# EAGLE design esquema-a4988 (EAGLE 9.3.0)
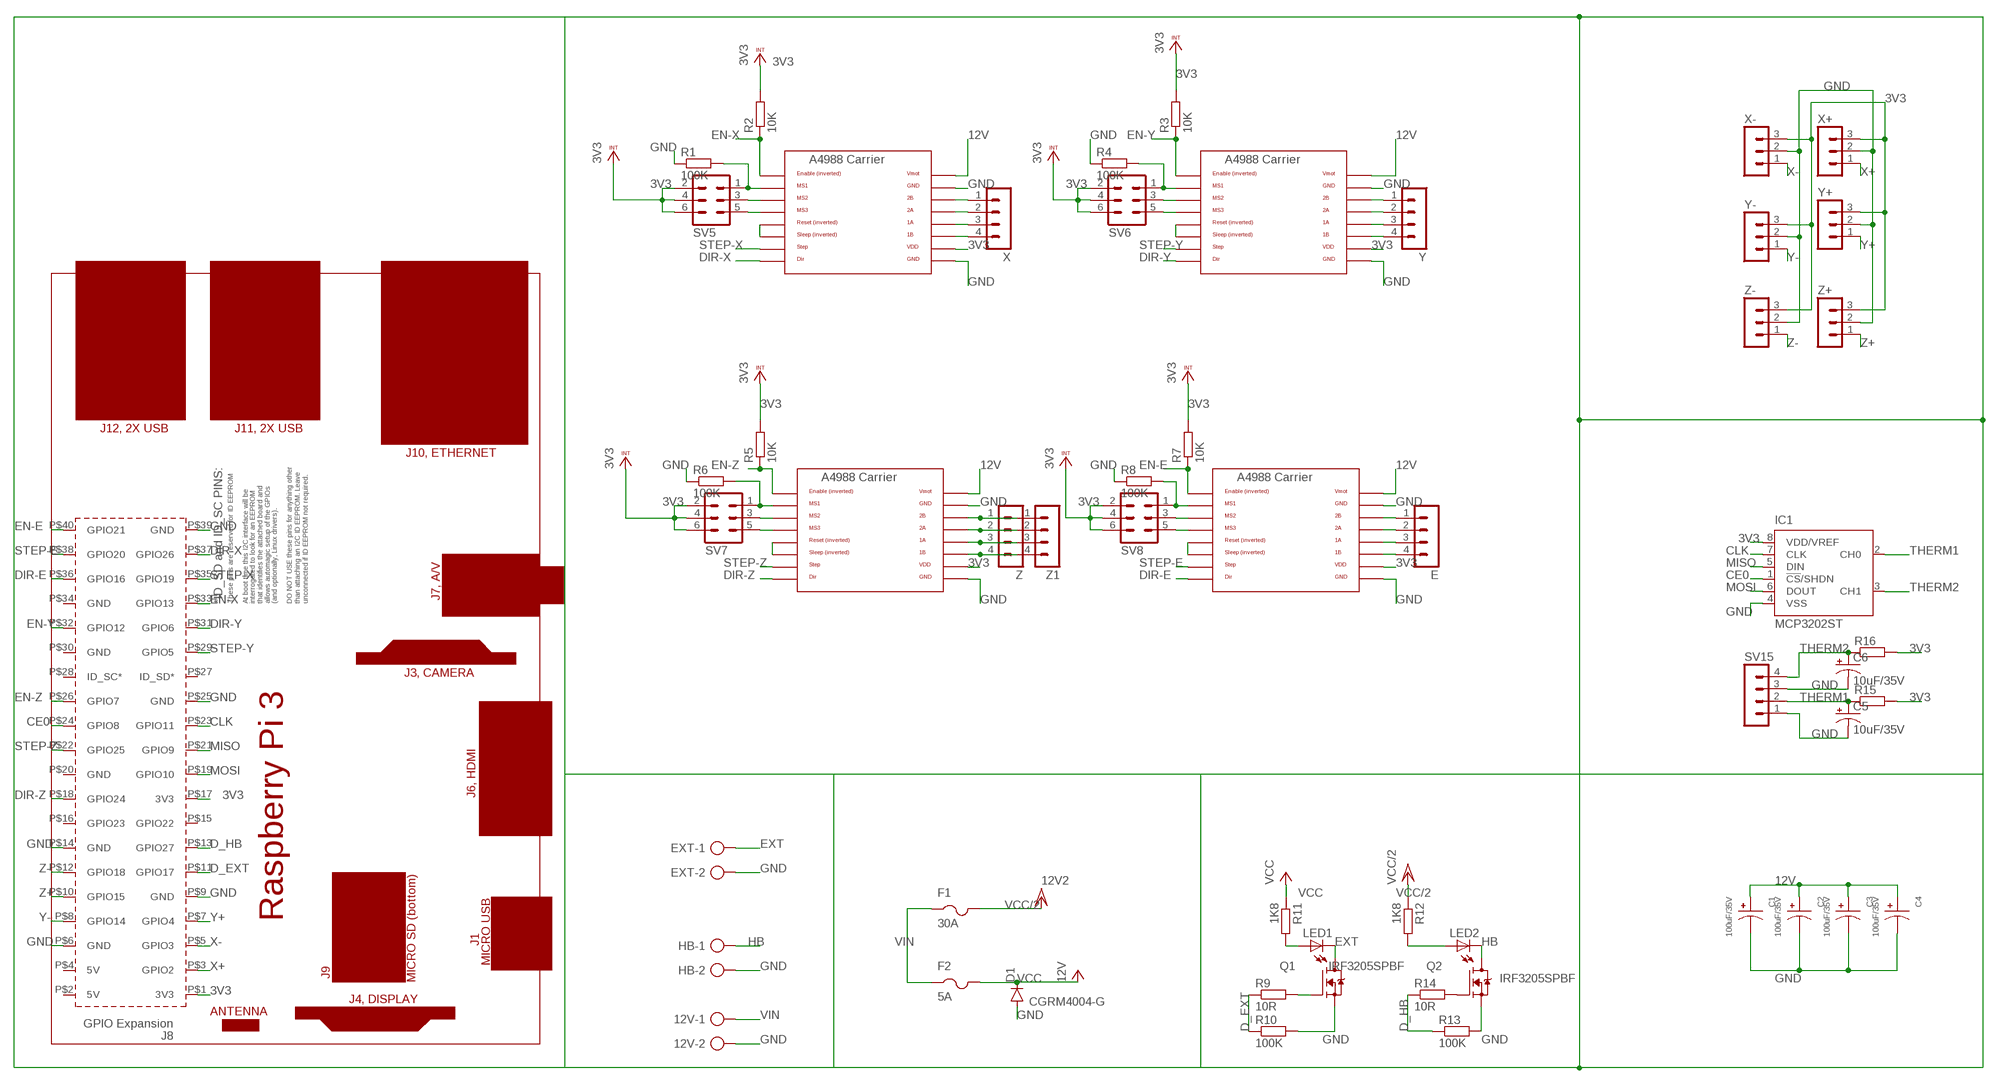
[diagram p0: schematic, sheet 1]

## Parts
12V  AK500/2  [AK500/2]
C1  100uF/35V  EEE-FTH101XAP  [CAPAE660X800N]
C2  100uF/35V  EEE-FTH101XAP  [CAPAE660X800N]
C3  100uF/35V  EEE-FTH101XAP  [CAPAE660X800N]
C4  100uF/35V  EEE-FTH101XAP  [CAPAE660X800N]
C5  10uF/35V  CPOL-US153CLV-0405  [153CLV-0405]
C6  10uF/35V  CPOL-US153CLV-0405  [153CLV-0405]
D1  CGRM4004-G  [SOD-123_MINI-SMA]
E  MA04-1  [MA04-1]
EXT  AK500/2  [AK500/2]
F1  30A  PTCFUSE-1206  [R1206]
F2  5A  PTCFUSE-1206  [R1206]
HB  AK500/2  [AK500/2]
IC1  MCP3202ST  [TSSOP8]
LED1  LEDCHIPLED_1206  [CHIPLED_1206]
LED2  LEDCHIPLED_1206  [CHIPLED_1206]
PCB1  RPI3RPI3  [RPI3]
Q1  IRF3205SPBF  [TRANS_IRF3205SPBF]
Q2  IRF3205SPBF  [TRANS_IRF3205SPBF]
R1  100K  RR1206  [R1206]
R2  10K  RR1206  [R1206]
R3  10K  RR1206  [R1206]
R4  100K  RR1206  [R1206]
R5  10K  RR1206  [R1206]
R6  100K  RR1206  [R1206]
R7  10K  RR1206  [R1206]
R8  100K  RR1206  [R1206]
R9  10R  RR1206  [R1206]
R10  100K  RR1206  [R1206]
R11  1K8  RR1206  [R1206]
R12  1K8  RR1206  [R1206]
R13  100K  RR1206  [R1206]
R14  10R  RR1206  [R1206]
R15  RR1206  [R1206]
R16  RR1206  [R1206]
SV5  MA03-2  [MA03-2]
SV6  MA03-2  [MA03-2]
SV7  MA03-2  [MA03-2]
SV8  MA03-2  [MA03-2]
SV15  MA04-1  [MA04-1]
U$1  A4983CARRIER  [A4988BREAKOUT]
U$2  A4983CARRIER  [A4988BREAKOUT]
U$3  A4983CARRIER  [A4988BREAKOUT]
U$4  A4983CARRIER  [A4988BREAKOUT]
X  MA04-1  [MA04-1]
X+  MA03-1  [MA03-1]
X-  MA03-1  [MA03-1]
Y  MA04-1  [MA04-1]
Y+  MA03-1  [MA03-1]
Y-  MA03-1  [MA03-1]
Z  MA04-1  [MA04-1]
Z1  MA04-1  [MA04-1]
Z+  MA03-1  [MA03-1]
Z-  MA03-1  [MA03-1]

## Nets
3V3: IC1.8(VDD/VREF) PCB1.P$1(3V3) PCB1.P$17(3V3) R2.2 R3.2 R5.2 R7.2 R15.2 R16.2 SV5.2 SV5.4 SV5.6 SV6.2 SV6.4 SV6.6 SV7.2 SV7.4 SV7.6 SV8.2 SV8.4 SV8.6 U$1.VDD U$2.VDD U$3.VDD U$4.VDD X+.3 X-.3 Y+.3 Y-.3 Z+.3 Z-.3
12V: C1.1 C2.1 C3.1 C4.1 U$1.VMOT U$2.VMOT U$3.VMOT U$4.VMOT
CE0: IC1.1(!CS!/SHDN) PCB1.P$24(GPIO8)
CLK: IC1.7(CLK) PCB1.P$23(GPIO11)
D_EXT: PCB1.P$11(GPIO17) R9.1 R10.1
D_HB: PCB1.P$13(GPIO27) R13.1 R14.1
DIR-E: PCB1.P$36(GPIO16) U$4.DIR
DIR-X: PCB1.P$37(GPIO26) U$1.DIR
DIR-Y: PCB1.P$31(GPIO6) U$2.DIR
DIR-Z: PCB1.P$18(GPIO24) U$3.DIR
EN-E: PCB1.P$40(GPIO21) R7.1 U$4.EN
EN-X: PCB1.P$33(GPIO13) R2.1 U$1.EN
EN-Y: PCB1.P$32(GPIO12) R3.1 U$2.EN
EN-Z: PCB1.P$26(GPIO7) R5.1 U$3.EN
EXT: EXT.1 LED1.C Q1.2(D)
GND: 12V.2 C1.2 C2.2 C3.2 C4.2 C5.- C6.- D1.A EXT.2 HB.2 IC1.4(VSS) PCB1.P$6(GND) PCB1.P$9(GND) PCB1.P$14(GND) PCB1.P$25(GND) PCB1.P$39(GND) Q1.3(S) Q2.3(S) R1.1 R4.1 R6.1 R8.1 R10.2 R13.2 SV15.1 SV15.3 U$1.GND U$1.GND@0(GND) U$2.GND U$2.GND@0(GND) U$3.GND U$3.GND@0(GND) U$4.GND U$4.GND@0(GND) X+.2 X-.2 Y+.2 Y-.2 Z+.2 Z-.2
HB: HB.1 LED2.C Q2.2(D)
MISO: IC1.5(DIN) PCB1.P$21(GPIO9)
MOSI: IC1.6(DOUT) PCB1.P$19(GPIO10)
N$1: R1.2 SV5.1 U$1.MS1
N$2: SV5.3 U$1.MS2
N$3: SV5.5 U$1.MS3
N$4: R4.2 SV6.1 U$2.MS1
N$5: SV6.3 U$2.MS2
N$6: SV6.5 U$2.MS3
N$7: R6.2 SV7.1 U$3.MS1
N$8: SV7.3 U$3.MS2
N$9: SV7.5 U$3.MS3
N$10: R8.2 SV8.1 U$4.MS1
N$11: SV8.3 U$4.MS2
N$12: SV8.5 U$4.MS3
N$13: U$3.2B Z1.1 Z.1
N$14: U$3.2A Z1.2 Z.2
N$15: U$3.1A Z1.3 Z.3
N$16: U$3.1B Z1.4 Z.4
N$17: E.1 U$4.2B
N$18: E.2 U$4.2A
N$19: E.3 U$4.1A
N$20: E.4 U$4.1B
N$21: U$2.2B Y.1
N$22: U$2.2A Y.2
N$23: U$2.1A Y.3
N$24: U$2.1B Y.4
N$25: U$1.2B X.1
N$26: U$1.2A X.2
N$27: U$1.1A X.3
N$28: U$1.1B X.4
N$31: LED1.A R11.2
N$32: LED2.A R12.2
N$33: Q1.1(G) R9.2
N$35: Q2.1(G) R14.2
N$44: U$3.RST U$3.SLP(SLEEP)
N$46: U$4.RST U$4.SLP(SLEEP)
N$47: U$2.RST U$2.SLP(SLEEP)
N$48: U$1.RST U$1.SLP(SLEEP)
STEP-E: PCB1.P$38(GPIO20) U$4.STEP
STEP-X: PCB1.P$35(GPIO19) U$1.STEP
STEP-Y: PCB1.P$29(GPIO5) U$2.STEP
STEP-Z: PCB1.P$22(GPIO25) U$3.STEP
THERM1: C5.+ IC1.2(CH0) R15.1 SV15.2
THERM2: C6.+ IC1.3(CH1) R16.1 SV15.4
VCC: D1.C F2.2 R11.1 ; supply symbol labelled 12V
VCC/2: F1.2 R12.1 ; supply symbol labelled 12V2
VIN: 12V.1 F1.1 F2.1
X+: PCB1.P$3(GPIO2) X+.1
X-: PCB1.P$5(GPIO3) X-.1
Y+: PCB1.P$7(GPIO4) Y+.1
Y-: PCB1.P$8(GPIO14) Y-.1
Z+: PCB1.P$10(GPIO15) Z+.1
Z-: PCB1.P$12(GPIO18) Z-.1
Unconnected: PCB1.P$2(5V) PCB1.P$4(5V) PCB1.P$15(GPIO22) PCB1.P$16(GPIO23) PCB1.P$20(GND) PCB1.P$27(ID_SD*) PCB1.P$28(ID_SC*) PCB1.P$30(GND) PCB1.P$34(GND)

## Library data of the parts
12V EXT HB = con-ptr500:AK500/2: CONNECTOR; OC_FARNELL: unknown; OC_NEWARK: unknown
C1-C4 = EEE-FTH101XAP:EEE-FTH101XAP: Cap Aluminum Lytic 100uF 50V 20% (6.3 X 7.7mm) SMD 0.34 Ohm 350mA 2000h 105Â°C Automotive T/R; AVAILABILITY: Unavailable; DESCRIPTION: Cap Aluminum Lytic 100uF 50V 20% _6.3 X 7.7mm_ SMD 0.34 Ohm 350mA 2000h 105°C Automotive T/R; MF: Panasonic Electronic; MP: EEE-FTH101XAP; PACKAGE: Radial Panasonic Electronic; PRICE: None
C5 C6 = adafruit:CPOL-US: POLARIZED CAPACITOR, American symbol
D1 = diode:CGRM400*-G: Molded plasitc,JEDEC SOD-123/Mini SMA Source: Comchip CGRM4001-G.pdf
E SV15 X Y Z Z1 = con-lstb:MA04-1: PIN HEADER; OC_FARNELL: unknown; OC_NEWARK: unknown
F1 F2 = adafruit:PTCFUSE: PTC fuses, resettable thermistors
IC1 = microchip:MCP3202: 2.7V Dual Channel 12-Bit A/D Converter with SPI Serial Interface Source: http://ww1.microchip.com/downloads/en/DeviceDoc/21034D.pdf; MF: MICROCHIP; MPN: MCP3202-CI/ST; OC_FARNELL: unknown; OC_NEWARK: 59K0226
LED1 LED2 = adafruit:LED: LED OSRAM: - CHIPLED LG R971, LG N971, LY N971, LG Q971, LY Q971, LO R971, LY R971 LH N974, LH R974 LS Q976, LO Q976, LY Q976 LO Q996 - Hyper CHIPLED LW Q18S LB Q993, LB Q99A, LB R99A - SideLED LS A670, LO A670, LY A670, LG A670, LP A670 LB A673, LV A673, LT A673, LW A673 LH A674 LY A675 LS A676, LA A676, LO A676, LY A676, LW A676 LS A679, LY A679, LG A679 - Hyper Micro SIDELED® LS Y876, LA Y876, LO Y876, LY Y876 LT Y87S - SmartLED LW L88C, LW L88S LB L89C, LB L89S, LG L890 LS L89K, LO L89K, LY L89K LS L896, LA L896, LO L896, LY L896 - TOPLED LS T670, LO T670, LY T670, LG T670, LP T670 LSG T670, LSP T670, LSY T670, LOP T670, LYG T670 LG T671, LOG T671, LSG T671 LB T673, LV T673, LT T673, LW T673 LH T674 LS T676, LA T676, LO T676, LY T676, LB T676, LH T676, LSB T676, LW T676 LB T67C, LV T67C, LT T67C, LS T67K, LO T67K, LY T67K, LW E67C LS E67B, LA E67B, LO E67B, LY E67B, LB E67C, LV E67C, LT E67C LW T67C LS T679, LY T679, LG T679 LS T770, LO T770, LY T770, LG T770, LP T770 LB T773, LV T773, LT T773, LW T773 LH T774 LS E675, LA E675, LY E675, LS T675 LS T776, LA T776, LO T776, LY T776, LB T776 LHGB T686 LT T68C, LB T68C - Hyper Mini TOPLED® LB M676 - Mini TOPLED Santana® LG M470 LS M47K, LO M47K, LY M47K Source: http://www.osram.convergy.de/
PCB1 = e14_Rpi3_RevA+mirror-pcb:RPI3: Device for Raspberry Pi 3 board created by Dave Young for www.element14.com More information and support community is available at https://www.element14.com/community/community/raspberry-pi Device for Raspberry Pi 3 board updated by Gerald Schwarz for www.element14.com On RPI3 addet the layer milling and created a mirrored shield.
Q1 Q2 = IRF3205SPBF:IRF3205SPBF: Single N-Channel 55 V 200 W 146 nC Hexfet Power Mosfet Surface Mount - D2PAK-3; AVAILABILITY: Unavailable; DESCRIPTION: Single N-Channel 55 V 200 W 146 nC Hexfet Power Mosfet Surface Mount - D2PAK-3; MF: Infineon Technologies; MP: IRF3205SPBF; PACKAGE: D2PAK Infineon; PRICE: None
R1-R16 = eagle-ltspice:R: RESISTOR, European symbol; SPICEMODEL: NONE; SPICEPREFIX: R
SV5-SV8 = con-lstb:MA03-2: PIN HEADER; OC_FARNELL: unknown; OC_NEWARK: unknown
U$1-U$4 = RepRapjr:A4983CARRIER
X+ X- Y+ Y- Z+ Z- = con-lstb:MA03-1: PIN HEADER; OC_FARNELL: unknown; OC_NEWARK: unknown

## Board
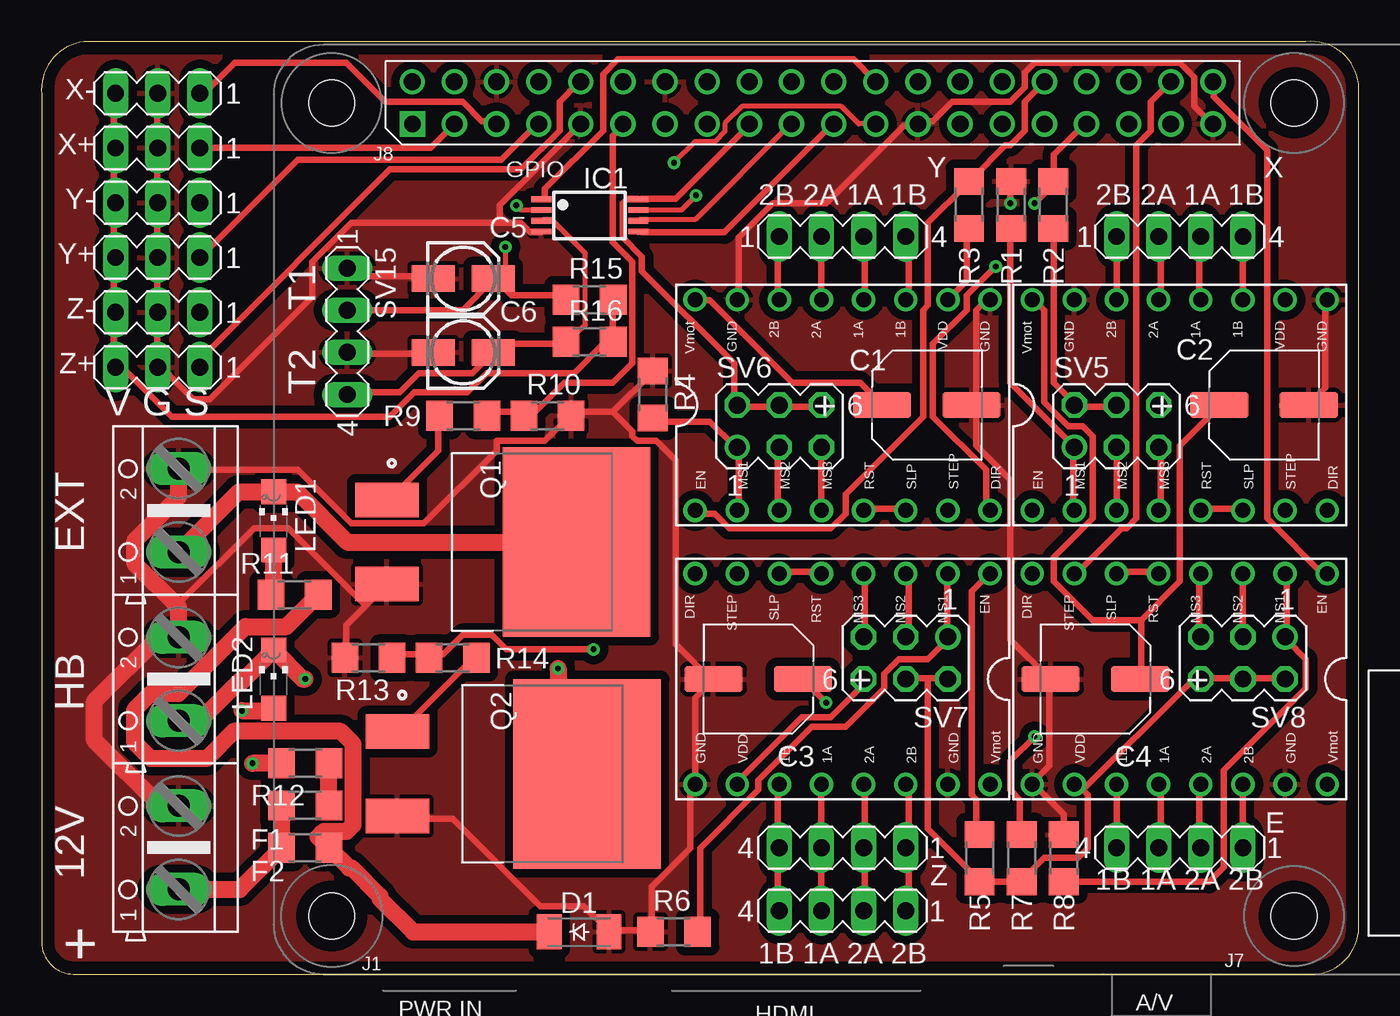
[diagram p1: board, top side]
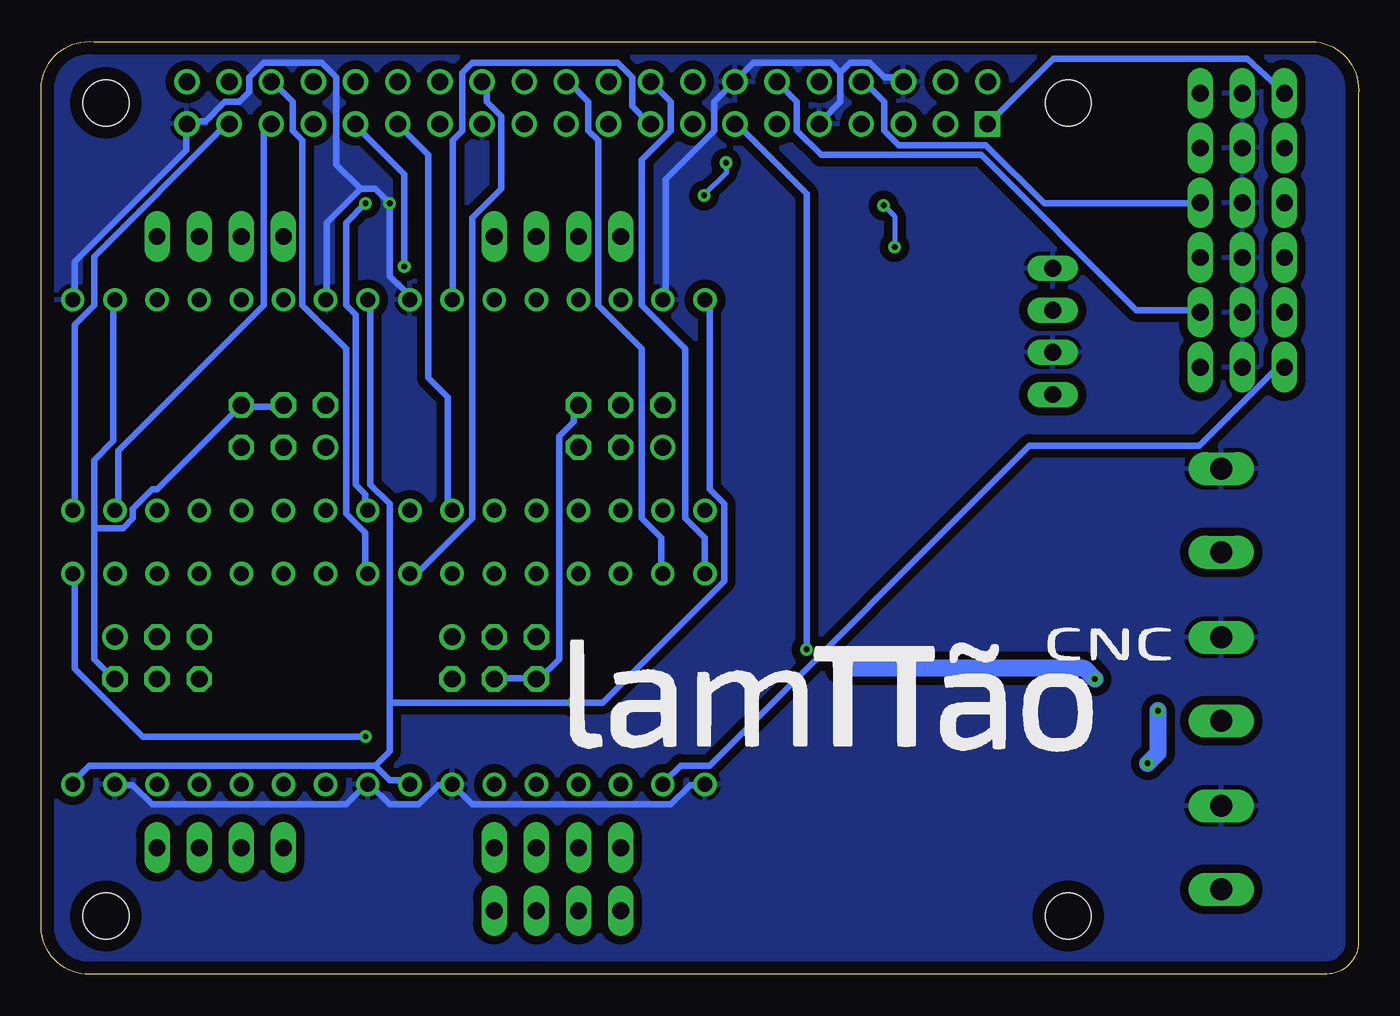
[diagram p2: board, bottom side, seen from below]

Size 79.37 x 56.22 mm. Coordinates in mm from the lower left corner, seen from the top.
Outline: 0.02,53.03 0.02,1.92 arc90 1.92,0.02 76.2,0.02 arc90 79.37,2.56 79.37,53.66 arc90 76.2,56.2 2.56,56.2 arc90 0.02,53.03
Copper layers (1*16): Top 0.035mm / dielectric 1.5mm / Bottom 0.035mm
Design rules "default *": minimum track width 12mil, minimum drill 0.35mm, track to track 8mil, track to pad 6mil, pad to pad 6mil, via to via 6mil, smd to smd 6mil, copper to edge 30mil, drill to drill 6mil, minimum pad ring 10mil, minimum via ring 8mil, stop-mask expansion 4mil, vias tented up to drill 0mil, thermal gap 10mil

### Footprints (pad centres in the part's own frame; a part is rotated, then mirrored left to right if it is on the bottom)
AK500/2 = drill 1.321 long: 1 -2.515,0; 2 2.515,0
CAPAE660X800N = smd 3.51 x 1.58: 1 -2.7,0; 2 2.7,0
153CLV-0405 = smd 2.6 x 1.6: + 1.8,0; - -1.8,0
SOD-123_MINI-SMA = smd 1.5 x 2.1: A 1.8,0; C -1.8,0
MA04-1 = drill 1.016 long: 1 -3.81,0; 2 -1.27,0; 3 1.27,0; 4 3.81,0
R1206 = smd 1.6 x 1.803: 1 -1.422,0; 2 1.422,0
TSSOP8 = smd 0.35 x 1.2: 1 -0.975,-2.925; 2 -0.325,-2.925; 3 0.325,-2.925; 4 0.975,-2.925; 5 0.975,2.925; 6 0.325,2.925; 7 -0.325,2.925; 8 -0.975,2.925
CHIPLED_1206 = smd 1.5 x 1.5: A 0,-1.75; C 0,1.75
RPI3 = drill 1.016 square: P$1 8.37,51.23 | drill 1.016: P$2 8.357,53.772; P$3 10.897,51.232; P$4 10.897,53.772; P$5 13.437,51.232; P$6 13.437,53.772; P$7 15.977,51.232; P$8 15.977,53.772; P$9 18.517,51.232; P$10 18.517,53.772; P$11 21.057,51.232; P$12 21.057,53.772; P$13 23.597,51.232; P$14 23.597,53.772; P$15 26.137,51.232; P$16 26.137,53.772; P$17 28.677,51.232; P$18 28.677,53.772; P$19 31.217,51.232; P$20 31.217,53.772; P$21 33.757,51.232; P$22 33.757,53.772; P$23 36.297,51.232; P$24 36.297,53.772; P$25 38.837,51.232; P$26 38.837,53.772; P$27 41.377,51.232; P$28 41.377,53.772; P$29 43.917,51.232; P$30 43.917,53.772; P$31 46.457,51.232; P$32 46.457,53.772; P$33 48.997,51.232; P$34 48.997,53.772; P$35 51.537,51.232; P$36 51.537,53.772; P$37 54.077,51.232; P$38 54.077,53.772; P$39 56.617,51.232; P$40 56.617,53.772 | hole 2.75: 3.5,3.5; 61.5,3.5; 3.5,52.5; 61.5,52.5
TRANS_IRF3205SPBF = smd 2.08 x 3.81: 1 -2.54,-7.14; 3 2.54,-7.14 | smd 11.43 x 8.89: 2 0,4.29
MA03-2 = drill 1.016: 1 -2.54,-1.27 | drill 1.016 octagon: 2 -2.54,1.27; 3 0,-1.27; 4 0,1.27; 5 2.54,-1.27; 6 2.54,1.27
A4988BREAKOUT = drill 0.9: 1A 8.89,1.27; 1B 11.43,1.27; 2A 6.35,1.27; 2B 3.81,1.27; DIR 16.51,-11.43; EN -1.27,-11.43; GND 16.51,1.27; GND@0 1.27,1.27; MS1 1.27,-11.43; MS2 3.81,-11.43; MS3 6.35,-11.43; RST 8.89,-11.43; SLP 11.43,-11.43; STEP 13.97,-11.43; VDD 13.97,1.27; VMOT -1.27,1.27
MA03-1 = drill 1.016 long: 1 -2.54,0; 2 0,0; 3 2.54,0

### Placement (x,y rotation side)
12V  8.27,7.64 90 top
C1  53.36,34.31 0 top
C2  73.68,34.31 0 top
C3  43.2,17.8 180 top
C4  63.52,17.8 180 top
C5  25.42,41.93 0 top
C6  25.42,37.48 0 top
D1  32.4,2.56 0 top
E  68.6,7.64 180 top
EXT  8.27,27.96 90 top
F1  15.89,10.18 0 top
F2  15.89,7.64 0 top
HB  8.27,17.8 90 top
IC1  33.04,45.74 270 top
LED1  13.99,27.32 0 top
LED2  13.99,17.8 0 top
PCB1  13.99,0.02 0 top
Q1  27.96,26.05 270 top
Q2  28.59,12.08 270 top
R1  58.44,46.37 270 top
R2  60.98,46.37 270 top
R3  55.9,46.37 270 top
R4  36.85,34.94 270 top
R5  56.53,7 270 top
R6  38.12,2.56 0 top
R7  59.07,7 270 top
R8  61.61,7 270 top
R9  25.42,33.67 180 top
R10  30.5,33.67 0 top
R11  15.26,22.88 180 top
R12  15.89,12.72 180 top
R13  19.7,19.07 180 top
R14  24.78,19.07 0 top
R15  33.04,40.66 0 top
R16  33.04,38.12 0 top
SV5  64.79,33.04 0 top
SV6  44.47,33.04 0 top
SV7  52.09,19.07 180 top
SV8  72.41,19.07 180 top
SV15  18.43,38.75 270 top
U$1  60.98,39.39 0 top
U$2  40.66,39.39 0 top
U$3  55.9,12.72 180 top
U$4  76.22,12.72 180 top
X  68.6,44.47 0 top
X+  7,49.8 180 top
X-  7,53.1 180 top
Y  48.28,44.47 0 top
Y+  7,43.2 180 top
Y-  7,46.5 180 top
Z  48.28,7.64 180 top
Z1  48.28,3.83 180 top
Z+  7,36.59 180 top
Z-  7,39.9 180 top

### Tracks (layer width: path | path; a pad name or v marks a point on that pad's centre or on a via)
3V3
  Top 0.381: X-.3 4.35,52.98 4.35,49.93 X+.3 4.35,49.64 4.35,46.59 Y-.3 4.35,46.3 4.35,43.25 Y+.3 4.35,42.96 4.35,39.91 Z-.3 4.35,39.62 4.35,36.86 Z+.3 4.94,36.53 7.85,33.61 21,33.61 22.46,35.07 25.67,35.07 26.84,36.24 32.1,36.24 33.85,37.99 34.43,37.99 R16.2 34.43,38.28 34.43,40.62 R15.2 | SV6.6 46.99,34.19 44.66,34.19 SV6.4 44.37,34.19 42.03,34.19 SV6.2 41.74,34.49 41.74,36.82 36.19,42.37 36.19,43.25 35.02,44.42 35.02,46.46 35.31,46.75 35.89,46.75 IC1.8 36.19,46.75 38.23,46.75 42.61,51.13 PCB1.P$17 | U$2.VDD 55.76,41.79 55.76,44.71 R3.2 | 53.42,17.84 54.59,17.84 SV7.2 | 53.42,17.84 52.25,17.84 SV7.4 | U$3.VDD 42.03,11.7 45.83,15.5 47.58,15.5 49.62,17.54 SV7.6 | R2.2 61.02,44.71 61.02,35.65 62.18,34.49 SV5.2 62.48,34.19 64.52,34.19 SV5.4 | 62.77,11.12 62.48,11.41 U$4.VDD 62.77,11.12 | 62.77,11.12 63.06,10.83 63.06,7.61 62.48,7.03 60.43,7.03 59.26,5.86 R7.2 58.97,5.57 56.63,5.57 R5.2 56.34,5.86 53.42,8.78 53.42,17.84 | 72.41,17.84 70.07,17.84 SV8.6 69.78,17.54 69.19,17.54 62.77,11.12 | 72.41,17.84 74.74,17.84 SV8.2 | 72.41,17.84 SV8.4
  Bottom 0.381: PCB1.P$1 22.17,51.43 18.41,55.19 6.7,55.19 4.48,53.12 X-.3 | U$2.VDD 54.59,40.91 54.59,50.26 54.01,50.84 54.01,54.35 53.42,54.93 44.66,54.93 43.78,54.06 43.78,52.3 42.91,51.43 PCB1.P$17 | SV7.4 51.96,17.84 49.62,17.84 SV7.6 49.33,17.84 48.16,19 48.16,32.44 47.29,33.32 47.29,34.19 SV6.6 | SV5.4 64.81,34.19 67.15,34.19 SV5.6 72.41,29.23 72.7,29.23 73.87,28.06 73.87,27.47 74.45,26.89 76.2,26.89 | 76.2,26.89 76.2,19 75.04,17.84 SV8.2 | 76.2,26.89 76.2,30.98 75.04,32.15 75.04,40.62 U$1.VDD | Z+.3 4.94,36.53 9.61,31.86 19.83,31.86 39.11,12.58 40.86,12.58 41.74,11.7 U$3.VDD
12V  (via drill 0.35)
  Top 0.381: 66.27,21.34 66.27,17.84 C4.1 | 66.27,21.34 68.61,23.68 68.61,31.86 70.95,34.19 C2.1 | U$2.VMOT 39.4,40.62 40.28,40.62 45.24,35.65 49.33,35.65 50.5,34.49 C1.1 | v47.29,16.38 46.12,17.54 C3.1 | 66.27,21.34 63.35,21.34 61.02,23.68 61.02,25.14 63.35,27.47 63.35,32.44 62.77,33.02 61.89,33.02 60.43,34.49 60.43,40.04 59.85,40.62 U$1.VMOT
  Bottom 0.381: 59.26,12.58 58.39,11.7 57.22,11.7 U$3.VMOT | 59.26,12.58 76.5,12.58 77.37,11.7 U$4.VMOT | 58.39,16.38 58.39,13.45 59.26,12.58 | 58.39,16.38 58.39,28.35 59.56,29.52 59.56,40.62 U$1.VMOT | 58.39,16.38 v47.29,16.38 45.53,16.38 38.23,23.68 38.23,28.35 39.11,29.23 39.11,40.62 U$2.VMOT
CE0
  Top 0.381: PCB1.P$24 48.94,55.14 34.73,55.14 33.85,54.26 33.85,50.84 30.35,47.34 30.35,46.75 IC1.1
CLK  (via drill 0.35)
  Top 0.305: PCB1.P$23 49.25,51.25 48.19,52.32 42.22,52.32 41.19,51.28 41.19,50.81 40.57,50.18 39.39,50.18 v38.12,48.91 | v39.45,46.95 38.56,46.06 IC1.7
  Bottom 0.305: v38.12,48.91 38.12,48.28 v39.45,46.95
D_EXT
  Top 0.381: R9.1 26.84,33.9 28.88,33.9 R10.1 29.18,33.9 29.76,33.9 31.51,35.65 34.43,35.65 35.6,36.82 35.6,42.96 34.43,44.12 34.43,50.55 35.02,51.13 PCB1.P$11
D_HB  (via drill 0.35)
  Top 0.381: R13.1 21.29,19.3 23.33,19.3 R14.1 23.63,19.3 24.21,19.3 25.38,20.46 27.13,20.46 28.01,19.59 v33.27,19.59
  Bottom 0.381: v33.27,19.59 33.27,47.05 37.36,51.13 PCB1.P$13
DIR-E
  Bottom 0.381: U$4.DIR 59.85,24.26 59.85,26.6 61.02,27.77 61.02,37.7 63.64,40.33 63.64,50.26 64.23,50.84 64.23,52.6 65.4,53.76 PCB1.P$36
DIR-X
  Bottom 0.381: U$1.DIR 77.37,28.06 77.37,39.16 76.2,40.33 76.2,43.25 68.32,51.13 PCB1.P$37
DIR-Y  (via drill 0.35)
  Top 0.381: v57.51,42.66 55.76,40.91 55.76,40.04 53.71,37.99 53.71,33.61 56.93,30.4 56.93,28.06 U$2.DIR
  Bottom 0.381: v57.51,42.66 57.51,48.21 60.43,51.13 PCB1.P$31
DIR-Z
  Bottom 0.381: U$3.DIR 39.4,24.26 39.4,26.31 40.57,27.47 40.57,37.7 43.2,40.33 43.2,49.09 41.44,50.84 41.44,52.6 42.61,53.76 PCB1.P$18
EN-E  (via drill 0.35)
  Top 0.381: v59.85,14.33 58.39,12.87 58.39,11.12 58.97,10.53 58.97,8.49 R7.1 | PCB1.P$40 70.65,53.76 70.65,52.89 73.87,49.67 73.87,27.47 77.37,23.97 U$4.EN
  Bottom 0.381: v59.85,14.33 73.28,14.33 77.37,18.42 77.37,23.97 U$4.EN
EN-X  (via drill 0.35)
  Top 0.381: PCB1.P$33 62.77,51.13 61.02,49.38 61.02,47.92 R2.1 61.02,47.63 v59.85,46.46
  Bottom 0.381: v59.85,46.46 61.02,45.29 61.02,40.33 60.43,39.74 60.43,29.52 59.85,28.94 59.85,28.06 U$1.EN
EN-Y
  Top 0.381: PCB1.P$32 60.43,53.76 59.26,52.6 59.26,50.84 58.39,49.97 58.09,49.97 56.05,47.92 R3.1 55.76,47.63 53.42,45.29 53.42,40.33 53.13,40.04 53.13,33.61 48.46,28.94 48.46,27.77 47.58,26.89 41.44,26.89 40.57,27.77 39.4,27.77 U$2.EN
EN-Z
  Top 0.381: R5.1 56.34,8.49 56.34,10.53 56.05,10.83 56.05,23.09 56.93,23.97 U$3.EN
  Bottom 0.381: PCB1.P$26 52.54,53.76 52.54,52.6 51.67,51.72 51.67,47.34 53.42,45.59 53.42,27.47 56.93,23.97 U$3.EN
EXT
  Top 1.016: EXT.1 11.9,29.07 LED1.C 15.41,29.07 18.43,26.05 Q1.2
GND  (via drill 0.35)
  Top 0.381: X+.2 6.98,49.93 6.98,52.98 X-.2 | X+.2 | X+.2 6.98,49.64 6.98,46.59 Y-.2 6.98,46.3 6.98,43.25 Y+.2 6.98,42.96 6.98,39.91 Z-.2 6.98,39.62 6.98,36.86 Z+.2 7.27,36.57 7.68,36.16 7.68,36.12 9.15,34.65 10.15,34.65 16.32,40.82 16.32,42.96 18.66,45.29 27.61,45.29 | 27.61,45.29 27.61,46.36 PCB1.P$9 | IC1.4 30.05,44.71 29.47,44.71 28.88,45.29 27.61,45.29 | U$2.GND@0 42.03,40.91 42.03,44.42 44.07,46.46 47.29,46.46 51.96,51.13 52.54,51.13 PCB1.P$25 52.84,51.43 53.71,51.43 54.88,52.6 58.39,52.6 59.26,53.47 59.26,54.35 59.85,54.93 68.61,54.93 69.49,54.06 69.49,52.3 70.36,51.43 PCB1.P$39 | 19.54,22.22 20.71,23.39 Q1.3 | 19.54,22.22 18.37,21.05 18.37,19.3 R13.2 | 19.54,22.22 14.86,26.89 12.82,26.89 8.44,22.51 8.27,22.12 | 34.43,33.9 32.1,33.9 R10.2 31.81,33.61 30.35,32.15 27.42,32.15 27.42,31.56 23.04,27.18 18.66,27.18 15.45,30.4 8.73,30.4 EXT.2 | 34.43,33.9 36.77,36.24 R4.1 | Q2.3 21.58,9.36 24.8,9.36 30.05,4.11 32.68,4.11 34.14,2.65 D1.A 34.43,2.65 36.48,2.65 R6.1 36.77,2.65 36.77,5.28 39.11,7.61 39.11,11.41 U$3.GND 39.4,11.7 39.4,16.67 40.28,17.54 C3.2 40.28,17.84 38.23,19.88 38.23,30.98 37.06,32.15 35.89,32.15 35.6,32.44 35.6,32.73 34.43,33.9 | U$1.GND 77.37,40.62 77.37,35.36 76.5,34.49 C2.2 | v58.39,46.46 58.39,47.63 R1.1 | U$2.GND 56.93,40.62 56.34,40.04 56.34,34.49 C1.2 56.34,34.19 56.34,31.86 58.39,29.81 58.39,20.17 60.72,17.84 C4.2 60.72,17.54 60.72,12.58 59.85,11.7 U$4.GND 59.85,11.41 61.6,9.66 61.6,8.49 R8.1 | C6.- 23.33,37.41 18.66,37.41 SV15.3 | C5.- 23.33,42.08 18.95,42.08 18.66,42.37 SV15.1
  Top 1.016: 12V.2 7.16,10.15 3.19,14.12 3.19,16.45 7.05,20.31 HB.2 8.27,22.12 5.63,24.76 5.63,26.13 8.27,28.77 EXT.2
  Bottom 0.381: 31.22,54.35 30.64,54.93 29.47,54.93 28.59,54.06 27.42,54.06 PCB1.P$6 | 31.22,54.35 31.22,52.6 32.39,51.43 PCB1.P$9 | U$2.GND@0 41.74,40.91 41.74,47.92 38.82,50.84 38.82,52.6 37.65,53.76 PCB1.P$14 37.36,54.06 36.48,54.93 31.81,54.93 31.22,54.35 | U$1.GND 77.37,40.91 77.37,42.96 70.65,49.67 70.65,51.13 PCB1.P$39 70.36,51.43 69.49,51.43 68.32,52.6 67.44,52.6 66.86,53.18 66.86,54.06 65.98,54.93 62.48,54.93 61.6,54.06 61.6,48.8 60.14,47.34 | U$2.GND 57.22,40.91 58.39,42.08 v58.39,46.46 59.26,47.34 60.14,47.34 | 60.14,47.34 62.18,45.29 62.18,40.91 U$1.GND@0 | U$4.GND@0 74.74,11.41 73.87,11.41 72.7,10.24 61.02,10.24 59.85,11.41 U$4.GND 59.56,11.41 58.39,10.24 56.63,10.24 55.47,11.41 54.88,11.41 U$3.GND@0 53.42,10.24 41.44,10.24 40.28,11.41 39.4,11.41 U$3.GND
  pour Top (isolate 0.508): -0.62,0.02 -0.62,53.99 1.92,56.53 76.85,56.53 79.39,53.99 79.39,2.56 79.39,1.92 76.85,-0.62 1.29,-0.62 0.02,-0.62
  pour Bottom (isolate 0.508): -1.25,1.29 -1.25,54.63 1.29,57.17 76.22,57.17 77.49,57.17 80.03,54.63 80.03,1.92 80.03,1.29 77.49,-1.25 1.29,-1.25
HB  (via drill 0.35)
  Top 1.016: HB.1 9.54,15.28 11.9,17.64 12.08,17.64 LED2.C 15.74,17.8 v15.89,17.8 | v31.13,18.43 31.13,16.53 31.77,15.89 31.77,13.2 Q2.2
  Bottom 1.016: v15.89,17.8 16.53,18.43 v31.13,18.43
MISO
  Top 0.381: IC1.5 36.19,44.71 41.15,44.71 47.58,51.13 PCB1.P$21
MOSI
  Top 0.305: IC1.6 36.09,45.48 39.39,45.48 44.98,51.07 PCB1.P$19
N$1
  Top 0.381: R1.2 58.39,44.71 58.39,35.65 62.18,31.86 SV5.1 62.18,31.56 62.18,28.06 U$1.MS1
N$2
  Top 0.381: U$1.MS2 64.81,28.06 64.81,31.56 SV5.3
N$3
  Top 0.381: U$1.MS3 67.44,28.06 67.44,31.56 SV5.5
N$4
  Top 0.381: R4.2 37.06,33.32 40.28,33.32 41.74,31.86 SV6.1 42.03,31.56 42.03,28.06 U$2.MS1
N$5
  Top 0.381: U$2.MS2 44.37,28.06 44.37,31.56 SV6.3
N$6
  Top 0.381: U$2.MS3 46.99,28.06 46.99,31.56 SV6.5
N$7
  Top 0.381: R6.2 39.69,2.65 39.69,7.61 43.2,11.12 43.2,11.7 46.41,14.91 48.46,14.91 50.79,17.25 50.79,18.13 51.67,19 53.42,19 54.59,20.17 SV7.1 54.59,20.46 54.59,23.97 U$3.MS1
N$8
  Top 0.381: U$3.MS2 52.25,23.97 52.25,20.46 SV7.3
N$9
  Top 0.381: U$3.MS3 49.62,23.97 49.62,20.46 SV7.5
N$10
  Top 0.381: R8.2 61.89,5.57 70.36,5.57 71.24,6.44 71.24,12.29 76.2,17.25 76.2,19 75.04,20.17 SV8.1 75.04,20.46 75.04,23.97 U$4.MS1
N$11
  Top 0.381: SV8.3 U$4.MS2
N$12
  Top 0.381: U$4.MS3 69.78,23.97 69.78,20.46 SV8.5
N$13
  Top 0.381: U$3.2B 52.25,11.41 52.25,7.9 Z.1 52.25,7.61 52.25,4.11 Z1.1
N$14
  Top 0.381: U$3.2A 49.62,11.41 49.62,7.9 Z.2 49.62,7.61 49.62,4.11 Z1.2
N$15
  Top 0.381: U$3.1A 46.99,11.41 46.99,7.9 Z.3 46.99,7.61 46.99,4.11 Z1.3
N$16
  Top 0.381: U$3.1B 44.37,11.41 44.37,7.9 Z.4 44.37,7.61 44.37,4.11 Z1.4
N$17
  Top 0.381: E.1 U$4.2B
N$18
  Top 0.381: U$4.2A 69.78,11.41 69.78,7.9 E.2
N$19
  Top 0.381: U$4.1A 67.44,11.41 67.44,7.9 E.3
N$20
  Top 0.381: U$4.1B 64.81,11.41 64.81,7.9 E.4
N$21
  Top 0.381: U$2.2B 44.37,40.91 44.37,44.42 Y.1
N$22
  Top 0.381: U$2.2A 46.99,40.91 46.99,44.42 Y.2
N$23
  Top 0.381: U$2.1A 49.62,40.91 49.62,44.42 Y.3
N$24
  Top 0.381: U$2.1B 52.25,40.91 52.25,44.42 Y.4
N$25
  Top 0.381: U$1.2B 64.81,40.91 64.81,44.42 X.1
N$26
  Top 0.381: U$1.2A 67.44,40.91 67.44,44.42 X.2
N$27
  Top 0.381: U$1.1A 69.78,40.91 69.78,44.42 X.3
N$28
  Top 0.381: X.4 U$1.1B
N$31
  Top 1.016: R11.2 13.99,23.03 LED1.A
N$32  (via drill 0.35)
  Top 1.016: R12.2 v12.72,12.72 | v12.08,15.89 13.83,15.89 LED2.A
  Bottom 1.016: v12.72,12.72 12.08,13.35 v12.08,15.89
N$33
  Top 0.381: R9.2 23.92,33.61 23.92,31.56 21,28.64 Q1.1
N$35
  Top 0.381: R14.2 25.96,19 21.58,14.62 Q2.1
N$44
  Top 0.381: U$3.SLP 44.66,24.26 46.99,24.26 U$3.RST
N$46
  Top 0.381: U$4.SLP 64.81,24.26 67.15,24.26 U$4.RST
N$47
  Top 0.381: U$2.RST 49.62,28.06 51.96,28.06 U$2.SLP
N$48
  Top 0.381: U$1.RST 70.07,28.06 72.41,28.06 U$1.SLP
STEP-E
  Top 0.381: U$4.STEP 62.48,24.26 65.1,26.89 65.4,26.89 65.98,27.47 65.98,49.97 66.86,50.84 66.86,52.6 68.03,53.76 PCB1.P$38
STEP-X
  Bottom 0.381: U$1.STEP 74.74,28.06 74.74,31.56 65.98,40.33 65.98,50.84 65.69,51.13 PCB1.P$35
STEP-Y
  Bottom 0.381: U$2.STEP 54.88,28.06 54.88,34.78 56.05,35.95 56.05,49.38 57.8,51.13 PCB1.P$29
STEP-Z
  Bottom 0.381: U$3.STEP 42.03,24.26 42.03,26.31 43.2,27.47 43.2,37.7 45.83,40.33 45.83,50.26 46.41,50.84 46.41,52.6 47.58,53.76 PCB1.P$22
THERM1  (via drill 0.35)
  Top 0.305: IC1.2 28.9,46.06 v28.62,46.35 | v27.96,43.83 27.96,42.67 C5.+
  Top 0.381: R15.1 31.51,40.91 28.3,40.91 27.42,41.79 C5.+ 27.13,41.79 25.38,40.04 18.66,40.04 SV15.2
  Bottom 0.305: v28.62,46.35 27.96,45.68 v27.96,43.83
THERM2
  Top 0.305: IC1.3 30.24,45.48 30.75,45.48 32.78,43.45 32.78,39.13 31.77,38.12 R16.1
  Top 0.381: R16.1 31.51,37.99 27.72,37.99 27.42,37.7 C6.+ 27.13,37.41 25.96,36.24 22.75,36.24 21.58,35.07 18.66,35.07 SV15.4
VCC
  Top 1.016: D1.C 22.39,2.56 20.39,4.57 20.39,4.72 18.69,6.42 18.54,6.42 F2.2 16.68,8.27 17.02,8.62 18.39,8.62 18.77,9 18.77,13.89 18.03,14.64 11.59,14.64 9.95,13 6.6,13 5.63,13.96 5.63,15.97 6.6,16.93 8.27,16.93 12.3,20.96 14.76,20.96 R11.1
VCC/2
  Top 1.016: F1.2 R12.1
VIN
  Top 1.016: 12V.1 11.96,5.12 F2.1 F1.1
X+
  Top 0.381: X+.1 23.46,49.8 24.8,51.13 PCB1.P$3
X-
  Top 0.381: PCB1.P$5 27.42,51.43 26.55,51.43 25.38,52.6 20.71,52.6 18.37,54.93 11.65,54.93 10,53.28 X-.1
Y+
  Top 0.381: Y+.1 9.61,43.25 15.45,49.09 27.72,49.09 29.76,51.13 PCB1.P$7
Y-
  Bottom 0.381: Y-.1 9.57,46.46 18.95,46.46 22.46,49.97 27.72,49.97 28.59,50.84 28.59,52.6 29.76,53.76 PCB1.P$8
Z+
  Top 0.381: Z+.1 9.69,37.19 21,48.51 28.88,48.51 31.22,50.84 31.22,52.6 32.39,53.76 PCB1.P$10
Z-
  Bottom 0.381: PCB1.P$12 33.85,52.6 33.85,50.84 32.39,49.38 22.75,49.38 13.4,40.04 10.24,40.04 Z-.1

### Text on the board
tPlace: 2B 2A 1A 1B | 2B 2A 1A 1B | T1 | T2 | V G S | 1B 1A 2A 2B | + | 1B 1A 2A 2B